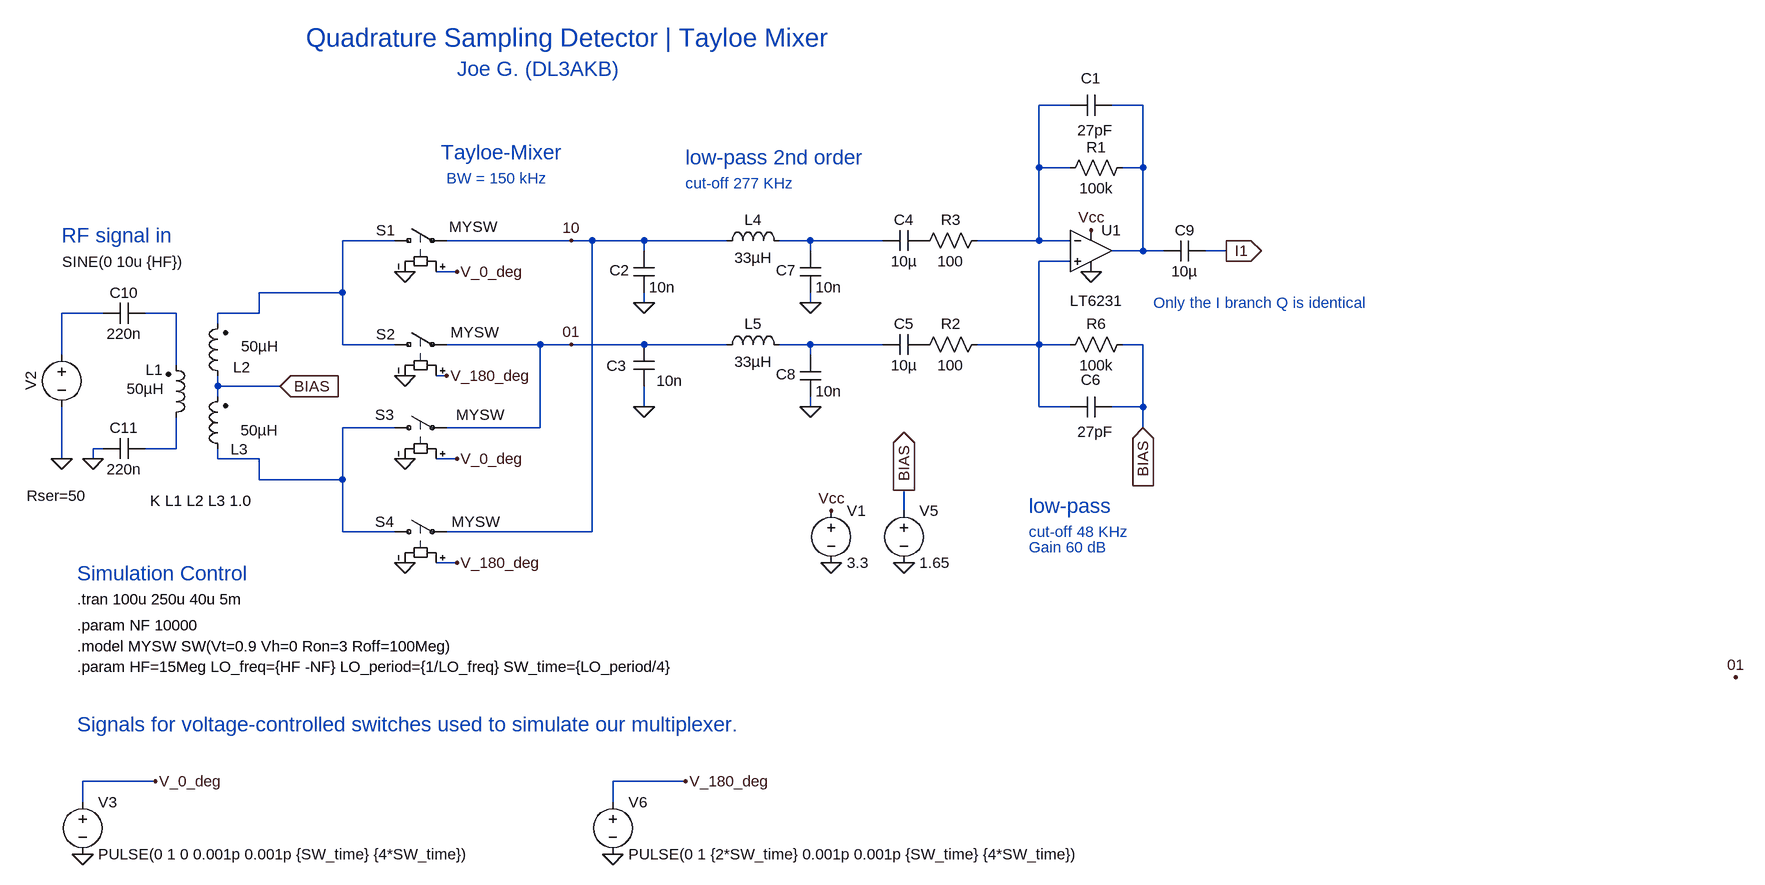
[diagram p0: schematic QSD_Simulation.asc]
QSD_Simulation.asc, the LTspice schematic file:
Version 4
SHEET 1 1280 680
WIRE -1024 -880 -1072 -880
WIRE -912 -880 -960 -880
WIRE -1072 -784 -1072 -880
WIRE -1024 -784 -1072 -784
WIRE -912 -784 -912 -880
WIRE -912 -784 -944 -784
WIRE -2064 -672 -2144 -672
WIRE -1792 -672 -1984 -672
WIRE -1760 -672 -1792 -672
WIRE -1680 -672 -1760 -672
WIRE -1552 -672 -1680 -672
WIRE -1424 -672 -1472 -672
WIRE -1312 -672 -1424 -672
WIRE -1072 -672 -1072 -784
WIRE -1072 -672 -1168 -672
WIRE -1024 -672 -1072 -672
WIRE -1680 -656 -1680 -672
WIRE -1424 -656 -1424 -672
WIRE -912 -656 -912 -784
WIRE -912 -656 -960 -656
WIRE -880 -656 -912 -656
WIRE -784 -656 -816 -656
WIRE -1024 -640 -1072 -640
WIRE -1968 -624 -2000 -624
WIRE -2144 -592 -2144 -672
WIRE -2144 -592 -2272 -592
WIRE -1680 -576 -1680 -592
WIRE -1424 -576 -1424 -592
WIRE -2512 -560 -2576 -560
WIRE -2400 -560 -2448 -560
WIRE -2272 -560 -2272 -592
WIRE -2272 -560 -2336 -560
WIRE -2336 -544 -2336 -560
WIRE -2144 -512 -2144 -592
WIRE -2064 -512 -2144 -512
WIRE -1840 -512 -1984 -512
WIRE -1792 -512 -1840 -512
WIRE -1680 -512 -1792 -512
WIRE -1552 -512 -1680 -512
WIRE -1424 -512 -1472 -512
WIRE -1312 -512 -1424 -512
WIRE -1072 -512 -1072 -640
WIRE -1072 -512 -1168 -512
WIRE -1024 -512 -1072 -512
WIRE -912 -512 -944 -512
WIRE -2576 -496 -2576 -560
WIRE -1424 -496 -1424 -512
WIRE -2400 -480 -2400 -560
WIRE -1984 -464 -2000 -464
WIRE -2336 -448 -2336 -464
WIRE -2240 -448 -2336 -448
WIRE -2336 -432 -2336 -448
WIRE -1680 -416 -1680 -448
WIRE -1424 -416 -1424 -432
WIRE -1072 -416 -1072 -512
WIRE -1024 -416 -1072 -416
WIRE -912 -416 -912 -512
WIRE -912 -416 -960 -416
WIRE -2064 -384 -2144 -384
WIRE -1840 -384 -1840 -512
WIRE -1840 -384 -1984 -384
WIRE -912 -384 -912 -416
WIRE -2512 -352 -2528 -352
WIRE -2400 -352 -2400 -400
WIRE -2400 -352 -2448 -352
WIRE -2576 -336 -2576 -416
WIRE -2528 -336 -2528 -352
WIRE -2336 -336 -2336 -352
WIRE -2272 -336 -2336 -336
WIRE -1968 -336 -2000 -336
WIRE -2272 -304 -2272 -336
WIRE -2144 -304 -2144 -384
WIRE -2144 -304 -2272 -304
WIRE -1280 -256 -1280 -288
WIRE -2144 -224 -2144 -304
WIRE -2064 -224 -2144 -224
WIRE -1760 -224 -1760 -672
WIRE -1760 -224 -1984 -224
WIRE -1968 -176 -2000 -176
WIRE -2432 160 -2544 160
WIRE -1616 160 -1728 160
WIRE -2544 192 -2544 160
WIRE -1728 192 -1728 160
FLAG -2048 -624 0
FLAG -2048 -464 0
FLAG -2048 -336 0
FLAG -2048 -176 0
FLAG -1968 -624 V_0_deg
FLAG -1984 -464 V_180_deg
FLAG -1968 -336 V_0_deg
FLAG -1968 -176 V_180_deg
FLAG -2576 -336 0
FLAG -1392 -256 Vcc
FLAG -992 -688 Vcc
FLAG -1680 -416 0
FLAG -1680 -576 0
FLAG -992 -624 0
FLAG -1392 -176 0
FLAG -784 -656 I1
IOPIN -784 -656 Out
FLAG -1280 -176 0
FLAG -1424 -416 0
FLAG -1424 -576 0
FLAG -1280 -288 BIAS
IOPIN -1280 -288 Out
FLAG -912 -384 BIAS
IOPIN -912 -384 In
FLAG -2240 -448 BIAS
IOPIN -2240 -448 In
FLAG -2544 272 0
FLAG -2432 160 V_0_deg
FLAG -1728 272 0
FLAG -1616 160 V_180_deg
FLAG -1792 -672 10
FLAG -1792 -512 01
FLAG 0 0 01
FLAG -2528 -336 0
SYMBOL sw -2080 -672 R270
WINDOW 0 16 -12 VRight 2
WINDOW 3 21 100 VRight 2
SYMATTR InstName S1
SYMATTR Value MYSW
SYMBOL sw -2080 -512 R270
WINDOW 0 16 -12 VRight 2
WINDOW 3 19 102 VRight 2
SYMATTR InstName S2
SYMATTR Value MYSW
SYMBOL sw -2080 -384 R270
WINDOW 0 20 -14 VRight 2
WINDOW 3 20 111 VRight 2
SYMATTR InstName S3
SYMATTR Value MYSW
SYMBOL sw -2080 -224 R270
WINDOW 0 15 -14 VRight 2
WINDOW 3 15 104 VRight 2
SYMATTR InstName S4
SYMATTR Value MYSW
SYMBOL voltage -2576 -512 R0
WINDOW 0 -32 56 VBottom 2
WINDOW 3 95 -143 Top 2
WINDOW 123 34 145 Bottom 2
WINDOW 39 -8 248 Bottom 2
SYMATTR InstName V2
SYMATTR Value SINE(0 10u {HF})
SYMATTR SpiceLine Rser=50
SYMBOL Opamps\\LT6231 -992 -656 R0
WINDOW 3 -33 77 Left 2
SYMATTR InstName U1
SYMBOL voltage -1392 -272 R0
WINDOW 123 0 0 Left 0
WINDOW 39 0 0 Left 0
SYMATTR InstName V1
SYMATTR Value 3.3
SYMBOL cap -960 -896 R90
WINDOW 0 -10 32 VBottom 2
WINDOW 3 39 25 VTop 2
SYMATTR InstName C1
SYMATTR Value 27pF
SYMBOL res -928 -800 R90
WINDOW 0 0 56 VBottom 2
WINDOW 3 32 56 VTop 2
SYMATTR InstName R1
SYMATTR Value 100k
SYMBOL cap -1696 -656 R0
WINDOW 0 -37 30 Left 2
SYMATTR InstName C2
SYMATTR Value 10n
SYMBOL cap -1696 -512 R0
WINDOW 0 -42 33 Left 2
WINDOW 3 35 56 Left 2
SYMATTR InstName C3
SYMATTR Value 10n
SYMBOL res -1152 -528 R90
WINDOW 0 0 56 VBottom 2
WINDOW 3 32 56 VTop 2
SYMATTR InstName R2
SYMATTR Value 100
SYMBOL res -1152 -688 R90
WINDOW 0 0 56 VBottom 2
WINDOW 3 32 56 VTop 2
SYMATTR InstName R3
SYMATTR Value 100
SYMBOL cap -1248 -688 R90
WINDOW 0 0 32 VBottom 2
WINDOW 3 32 32 VTop 2
SYMATTR InstName C4
SYMATTR Value 10µ
SYMBOL cap -1248 -528 R90
WINDOW 0 0 32 VBottom 2
WINDOW 3 32 32 VTop 2
SYMATTR InstName C5
SYMATTR Value 10µ
SYMBOL res -928 -528 R90
WINDOW 0 0 56 VBottom 2
WINDOW 3 32 56 VTop 2
SYMATTR InstName R6
SYMATTR Value 100k
SYMBOL cap -960 -432 R90
WINDOW 0 -10 32 VBottom 2
WINDOW 3 39 25 VTop 2
SYMATTR InstName C6
SYMATTR Value 27pF
SYMBOL voltage -1280 -272 R0
WINDOW 123 0 0 Left 0
WINDOW 39 0 0 Left 0
SYMATTR InstName V5
SYMATTR Value 1.65
SYMBOL ind -1568 -656 R270
WINDOW 0 32 56 VTop 2
WINDOW 3 5 56 VBottom 2
SYMATTR InstName L4
SYMATTR Value 33µH
SYMBOL ind -1568 -496 R270
WINDOW 0 32 56 VTop 2
WINDOW 3 5 56 VBottom 2
SYMATTR InstName L5
SYMATTR Value 33µH
SYMBOL cap -1440 -656 R0
WINDOW 0 -37 30 Left 2
SYMATTR InstName C7
SYMATTR Value 10n
SYMBOL cap -1440 -496 R0
WINDOW 0 -37 30 Left 2
SYMATTR InstName C8
SYMATTR Value 10n
SYMBOL ind2 -2416 -384 M180
WINDOW 0 -31 89 Left 2
WINDOW 3 -60 60 Left 2
SYMATTR InstName L1
SYMATTR Value 50µH
SYMBOL ind2 -2320 -448 R180
WINDOW 0 -35 29 Left 2
WINDOW 3 -78 61 Left 2
SYMATTR InstName L2
SYMATTR Value 50µH
SYMBOL ind2 -2320 -336 R180
WINDOW 0 -31 15 Left 2
WINDOW 3 -77 44 Left 2
SYMATTR InstName L3
SYMATTR Value 50µH
SYMBOL voltage -2544 176 R0
WINDOW 123 0 0 Left 0
WINDOW 39 0 0 Left 0
SYMATTR InstName V3
SYMATTR Value PULSE(0 1 0 0.001p 0.001p {SW_time} {4*SW_time})
SYMBOL voltage -1728 176 R0
WINDOW 123 0 0 Left 0
WINDOW 39 0 0 Left 0
SYMATTR InstName V6
SYMATTR Value PULSE(0 1 {2*SW_time} 0.001p 0.001p {SW_time} {4*SW_time})
SYMBOL cap -816 -672 R90
WINDOW 0 0 32 VBottom 2
WINDOW 3 32 32 VTop 2
SYMATTR InstName C9
SYMATTR Value 10µ
SYMBOL cap -2448 -576 R90
WINDOW 0 0 32 VBottom 2
WINDOW 3 32 32 VTop 2
SYMATTR InstName C10
SYMATTR Value 220n
SYMBOL cap -2448 -368 R90
WINDOW 0 0 32 VBottom 2
WINDOW 3 32 32 VTop 2
SYMATTR InstName C11
SYMATTR Value 220n
TEXT -2552 -48 Left 2 !.model MYSW SW(Vt=0.9 Vh=0 Ron=3 Roff=100Meg)
TEXT -2552 -120 Left 2 !.tran 100u 250u 40u 5m
TEXT -2552 -16 Left 2 !.param HF=15Meg LO_freq={HF -NF} LO_period={1/LO_freq} SW_time={LO_period/4}
TEXT -2552 72 Left 3 ;Signals for voltage-controlled switches used to simulate our multiplexer.
TEXT -1992 -808 Left 3 ;Tayloe-Mixer
TEXT -2552 -160 Left 3 ;Simulation Control
TEXT -2552 -80 Left 2 !.param NF 10000
TEXT -2576 -680 Left 3 ;RF signal in
TEXT -1616 -800 Left 3 ;low-pass 2nd order
TEXT -1616 -760 Left 2 ;cut-off 277 KHz
TEXT -2440 -272 Left 2 !K L1 L2 L3 1.0
TEXT -1984 -768 Left 2 ;BW = 150 kHz
TEXT -1088 -264 Left 3 ;low-pass
TEXT -1088 -224 Left 2 ;cut-off 48 KHz
TEXT -1088 -200 Left 2 ;Gain 60 dB
TEXT -2200 -984 Left 4 ;Quadrature Sampling Detector | Tayloe Mixer
TEXT -1968 -936 Left 3 ;Joe G. (DL3AKB)
TEXT -896 -576 Left 2 ;Only the I branch Q is identical

The netlist it stands for:
* QSD_Simulation.asc
S1 N003 10 V_0_deg 0 MYSW
S2 N003 01 V_180_deg 0 MYSW
S3 N009 01 V_0_deg 0 MYSW
S4 N009 10 V_180_deg 0 MYSW
V2 N006 0 SINE(0 10u {HF}) Rser=50
XU1 N005 N001 N002 Vcc 0 LT6231  ; pins In+ In- OUT V+ V-
V1 Vcc 0 3.3
C1 N002 N001 27pF
R1 N002 N001 100k
C2 10 0 10n
C3 01 0 10n
R2 N005 P001 100
R3 N001 P002 100
C4 P002 N004 10µ
C5 P001 N008 10µ
R6 BIAS N005 100k
C6 BIAS N005 27pF
V5 BIAS 0 1.65
L4 10 N004 33µH
L5 01 N008 33µH
C7 N004 0 10n
C8 N008 0 10n
L1 N010 N007 50µH
L2 BIAS N003 50µH
L3 N009 BIAS 50µH
V3 V_0_deg 0 PULSE(0 1 0 0.001p 0.001p {SW_time} {4*SW_time})
V6 V_180_deg 0 PULSE(0 1 {2*SW_time} 0.001p 0.001p {SW_time} {4*SW_time})
C9 I1 N002 10µ
C10 N007 N006 220n
C11 N010 0 220n
.model MYSW SW(Vt=0.9 Vh=0 Ron=3 Roff=100Meg)
.tran 100u 250u 40u 5m
.param HF=15Meg LO_freq={HF -NF} LO_period={1/LO_freq} SW_time={LO_period/4}
* Signals for voltage-controlled switches used to simulate our multiplexer.
* Tayloe-Mixer
* Simulation Control
.param NF 10000
* RF signal in
* low-pass 2nd order
* cut-off 277 KHz
K L1 L2 L3 1.0
* BW = 150 kHz
* low-pass
* cut-off 48 KHz
* Gain 60 dB
* Quadrature Sampling Detector | Tayloe Mixer
* Joe G. (DL3AKB)
* Only the I branch Q is identical
.lib LTC2.lib
.backanno
.end